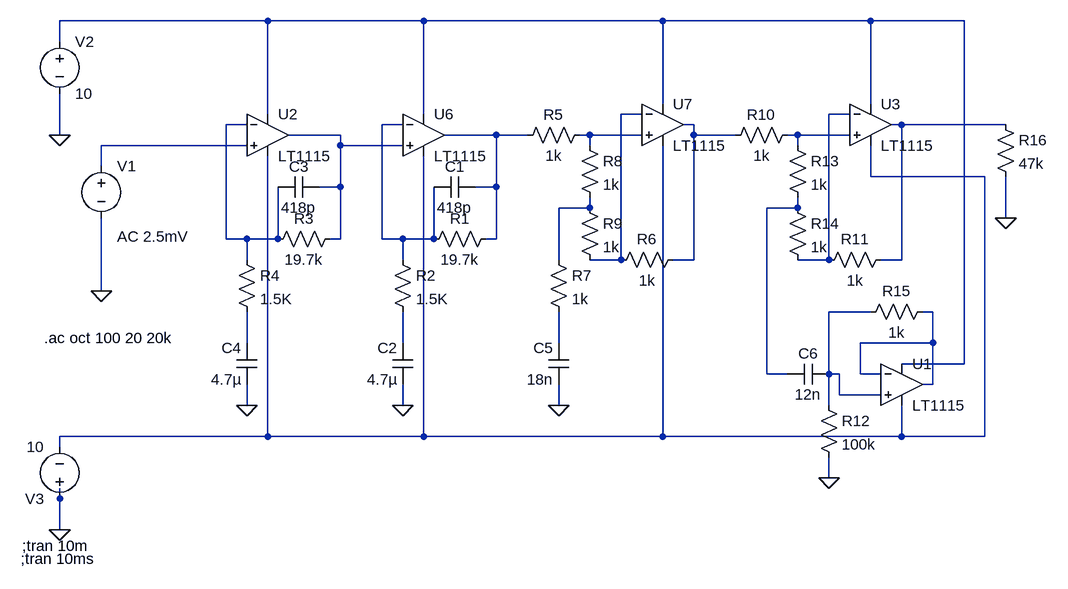
[diagram p0: schematic Pre-amp.asc]
Pre-amp.asc, the LTspice schematic file:
Version 4
SHEET 1 1136 680
WIRE -224 -192 -544 -192
WIRE 16 -192 -224 -192
WIRE 384 -192 16 -192
WIRE 704 -192 384 -192
WIRE 848 -192 704 -192
WIRE -544 -160 -544 -192
WIRE 384 -64 384 -192
WIRE 704 -64 704 -192
WIRE -224 -48 -224 -192
WIRE 16 -48 16 -192
WIRE 352 -48 320 -48
WIRE 672 -48 640 -48
WIRE -256 -32 -288 -32
WIRE -16 -32 -48 -32
WIRE 432 -32 416 -32
WIRE 752 -32 736 -32
WIRE 912 -32 752 -32
WIRE -544 -16 -544 -80
WIRE -112 -16 -192 -16
WIRE 128 -16 48 -16
WIRE 176 -16 128 -16
WIRE 272 -16 256 -16
WIRE 352 -16 272 -16
WIRE 432 -16 432 -32
WIRE 496 -16 432 -16
WIRE 592 -16 576 -16
WIRE 672 -16 592 -16
WIRE -256 0 -480 0
WIRE -112 0 -112 -16
WIRE -16 0 -112 0
WIRE 272 0 272 -16
WIRE 592 0 592 -16
WIRE -480 32 -480 0
WIRE 704 48 704 0
WIRE 880 48 704 48
WIRE -112 64 -112 0
WIRE -112 64 -144 64
WIRE 128 64 128 -16
WIRE 128 64 96 64
WIRE 272 96 272 80
WIRE 272 96 224 96
WIRE 592 96 592 80
WIRE 592 96 544 96
WIRE 912 112 912 48
WIRE -288 144 -288 -32
WIRE -256 144 -288 144
WIRE -208 144 -208 64
WIRE -208 144 -256 144
WIRE -112 144 -112 64
WIRE -112 144 -128 144
WIRE -48 144 -48 -32
WIRE -16 144 -48 144
WIRE 32 144 32 64
WIRE 32 144 -16 144
WIRE 128 144 128 64
WIRE 128 144 112 144
WIRE -256 176 -256 144
WIRE -16 176 -16 144
WIRE 224 176 224 96
WIRE 320 176 320 -48
WIRE 320 176 272 176
WIRE 432 176 432 -16
WIRE 432 176 400 176
WIRE 640 176 640 -48
WIRE 640 176 592 176
WIRE 752 176 752 -32
WIRE 752 176 720 176
WIRE -480 224 -480 112
WIRE 704 256 640 256
WIRE 800 256 784 256
WIRE -256 304 -256 256
WIRE -16 304 -16 256
WIRE 224 304 224 256
WIRE 800 304 800 256
WIRE 800 304 688 304
WIRE 848 336 848 -192
WIRE 848 336 752 336
WIRE 544 352 544 96
WIRE 576 352 544 352
WIRE 640 352 640 256
WIRE 656 352 640 352
WIRE 688 352 688 304
WIRE 720 352 688 352
WIRE 800 368 800 304
WIRE 800 368 784 368
WIRE 656 384 656 352
WIRE 720 384 656 384
WIRE -256 400 -256 368
WIRE -16 400 -16 368
WIRE 224 400 224 368
WIRE 640 400 640 352
WIRE -224 448 -224 16
WIRE -224 448 -544 448
WIRE 16 448 16 16
WIRE 16 448 -224 448
WIRE 384 448 384 0
WIRE 384 448 16 448
WIRE 752 448 752 400
WIRE 752 448 384 448
WIRE 880 448 880 48
WIRE 880 448 752 448
WIRE -544 464 -544 448
WIRE 640 512 640 480
WIRE -544 544 -544 528
WIRE -544 592 -544 544
FLAG -16 400 0
FLAG -256 400 0
FLAG 224 400 0
FLAG 640 512 0
FLAG -480 224 0
FLAG -544 -16 0
FLAG -544 592 0
FLAG 912 112 0
SYMBOL Opamps\\LT1115 16 -80 R0
SYMATTR InstName U6
SYMBOL Opamps\\LT1115 384 -96 R0
SYMATTR InstName U7
SYMBOL res 128 128 R90
WINDOW 0 0 56 VBottom 2
WINDOW 3 32 56 VTop 2
SYMATTR InstName R1
SYMATTR Value 19.7k
SYMBOL res -32 160 R0
SYMATTR InstName R2
SYMATTR Value 1.5K
SYMBOL cap 96 48 R90
WINDOW 0 0 32 VBottom 2
WINDOW 3 32 32 VTop 2
SYMATTR InstName C1
SYMATTR Value 418p
SYMBOL cap 0 368 R180
WINDOW 0 24 56 Left 2
WINDOW 3 24 8 Left 2
SYMATTR InstName C2
SYMATTR Value 4.7µ
SYMBOL Opamps\\LT1115 -224 -80 R0
SYMATTR InstName U2
SYMBOL res -112 128 R90
WINDOW 0 0 56 VBottom 2
WINDOW 3 32 56 VTop 2
SYMATTR InstName R3
SYMATTR Value 19.7k
SYMATTR SpiceLine tol=5 pwr=0.25
SYMBOL res -272 160 R0
SYMATTR InstName R4
SYMATTR Value 1.5K
SYMATTR SpiceLine tol=5 pwr=0.25
SYMBOL cap -144 48 R90
WINDOW 0 0 32 VBottom 2
WINDOW 3 32 32 VTop 2
SYMATTR InstName C3
SYMATTR Value 418p
SYMBOL cap -240 368 R180
WINDOW 0 24 56 Left 2
WINDOW 3 24 8 Left 2
SYMATTR InstName C4
SYMATTR Value 4.7µ
SYMBOL res 272 -32 R90
WINDOW 0 0 56 VBottom 2
WINDOW 3 32 56 VTop 2
SYMATTR InstName R5
SYMATTR Value 1k
SYMBOL res 416 160 R90
WINDOW 0 0 56 VBottom 2
WINDOW 3 32 56 VTop 2
SYMATTR InstName R6
SYMATTR Value 1k
SYMBOL res 208 160 R0
SYMATTR InstName R7
SYMATTR Value 1k
SYMBOL cap 240 368 R180
WINDOW 0 24 56 Left 2
WINDOW 3 24 8 Left 2
SYMATTR InstName C5
SYMATTR Value 18n
SYMBOL res 256 -16 R0
SYMATTR InstName R8
SYMATTR Value 1k
SYMBOL res 256 80 R0
SYMATTR InstName R9
SYMATTR Value 1k
SYMBOL Opamps\\LT1115 704 -96 R0
SYMATTR InstName U3
SYMBOL res 592 -32 R90
WINDOW 0 0 56 VBottom 2
WINDOW 3 32 56 VTop 2
SYMATTR InstName R10
SYMATTR Value 1k
SYMBOL res 736 160 R90
WINDOW 0 0 56 VBottom 2
WINDOW 3 32 56 VTop 2
SYMATTR InstName R11
SYMATTR Value 1k
SYMBOL res 576 -16 R0
SYMATTR InstName R13
SYMATTR Value 1k
SYMBOL res 576 80 R0
SYMATTR InstName R14
SYMATTR Value 1k
SYMBOL Opamps\\LT1115 752 304 R0
SYMATTR InstName U1
SYMBOL cap 640 336 R90
WINDOW 0 0 32 VBottom 2
WINDOW 3 32 32 VTop 2
SYMATTR InstName C6
SYMATTR Value 12n
SYMBOL res 624 384 R0
SYMATTR InstName R12
SYMATTR Value 100k
SYMBOL res 800 240 R90
WINDOW 0 0 56 VBottom 2
WINDOW 3 32 56 VTop 2
SYMATTR InstName R15
SYMATTR Value 1k
SYMBOL voltage -480 16 R0
WINDOW 3 24 152 Left 2
WINDOW 123 24 124 Left 2
WINDOW 39 0 0 Left 2
SYMATTR InstName V1
SYMATTR Value ""
SYMATTR Value2 AC 2.5mV
SYMBOL voltage -544 -176 R0
WINDOW 123 0 0 Left 2
WINDOW 39 0 0 Left 2
SYMATTR InstName V2
SYMATTR Value 10
SYMBOL voltage -544 560 R180
WINDOW 123 0 0 Left 2
WINDOW 39 0 0 Left 2
SYMATTR InstName V3
SYMATTR Value 10
SYMBOL res 896 -48 R0
SYMATTR InstName R16
SYMATTR Value 47k
TEXT -602 616 Left 2 !;tran 10m
TEXT -604 636 Left 2 !;tran 10ms
TEXT -568 296 Left 2 !.ac oct 100 20 20k

The netlist it stands for:
* Pre-amp.asc
XU6 N008 N005 N001 N013 N009 LT1028  ; LT1115, pins In+ In- V+ V- OUT
XU7 N010 N002 N001 N013 N006 LT1028  ; LT1115, pins In+ In- V+ V- OUT
R1 N009 N005 19.7k
R2 N005 N019 1.5K
C1 N009 N005 418p
C2 0 N019 4.7µ
XU2 N012 N004 N001 N013 N008 LT1028  ; LT1115, pins In+ In- V+ V- OUT
R3 N008 N004 19.7k tol=5 pwr=0.25
R4 N004 N018 1.5K tol=5 pwr=0.25
C3 N008 N004 418p
C4 0 N018 4.7µ
R5 N010 N009 1k
R6 N006 N002 1k
R7 N014 N020 1k
C5 0 N020 18n
R8 N010 N014 1k
R9 N014 N002 1k
XU3 N011 N003 N001 N013 N007 LT1028  ; LT1115, pins In+ In- V+ V- OUT
R10 N011 N006 1k
R11 N007 N003 1k
R13 N011 N015 1k
R14 N015 N003 1k
XU1 N016 N017 N001 N013 N017 LT1028  ; LT1115, pins In+ In- V+ V- OUT
C6 N016 N015 12n
R12 N016 0 100k
R15 N017 N016 1k
V1 N012 0 AC 2.5mV
V2 N001 0 10
V3 0 N013 10
R16 N007 0 47k
;tran 10m
;tran 10ms
.ac oct 100 20 20k
.lib LTC.lib
.backanno
.end